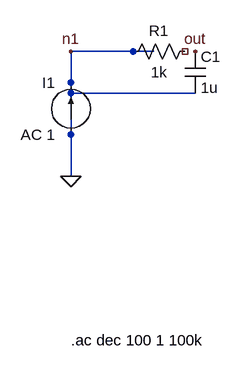
[diagram p0: schematic 00_converter_test_rc_lowpass.asc]
00_converter_test_rc_lowpass.asc, the LTspice schematic file:
Version 4
SHEET 1 880 736
WIRE 0 256 0 192
WIRE 128 192 0 192
WIRE 192 256 0 256
WIRE 0 256 0 384
FLAG 0 384 0
FLAG 0 192 n1
FLAG 192 192 out
SYMBOL current 0 320 R180
WINDOW 0 24 80 Left 2
WINDOW 3 24 0 Left 2
SYMATTR InstName I1
SYMATTR Value AC 1
SYMBOL res 192 176 R90
WINDOW 0 0 56 VBottom 2
WINDOW 3 32 56 VTop 2
SYMATTR InstName R1
SYMATTR Value 1k
SYMBOL cap 176 192 R0
SYMATTR InstName C1
SYMATTR Value 1u
TEXT 0 636 Left 2 !.ac dec 100 1 100k

The netlist it stands for:
* 00_converter_test_rc_lowpass.asc
I1 0 0 AC 1
R1 NC_01 0 1k
C1 out 0 1u
.ac dec 100 1 100k
.backanno
.end